# Altium schematic sheet LCL_2.SchDoc
size A4; SheetNumber: 3; SheetTotal: 5
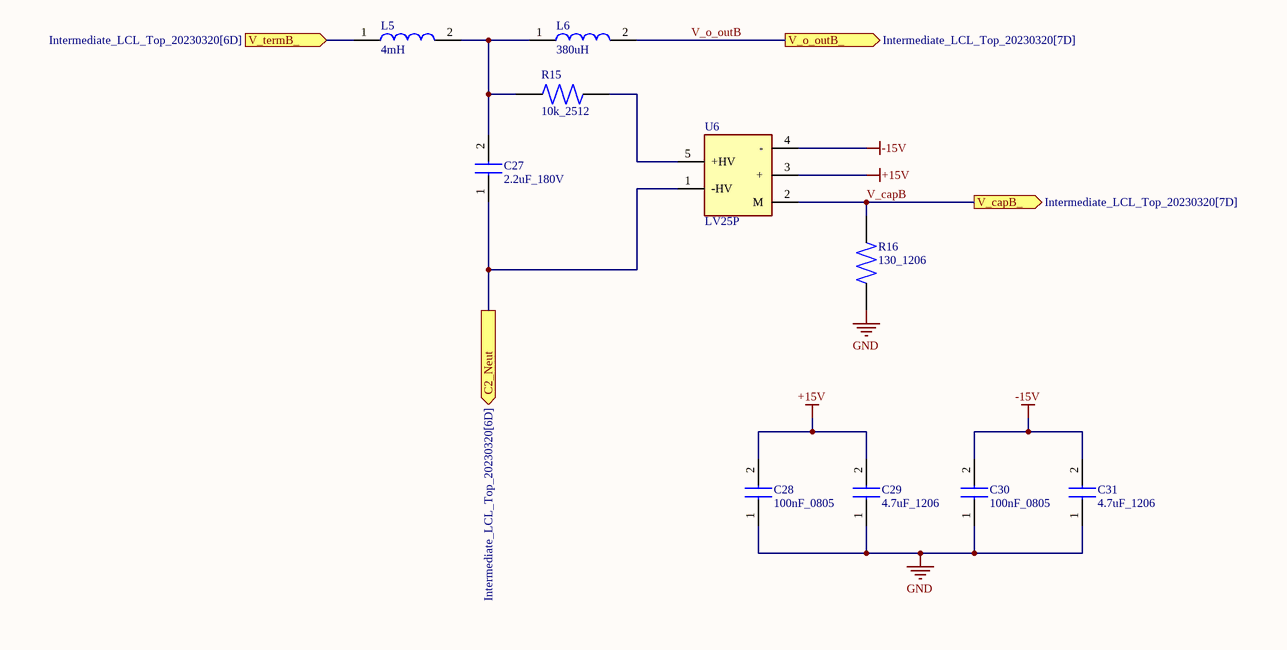
[diagram p0: LCL_2.SchDoc]

## Parts
C27  2.2uF_180V  [Film Capacitor PHE450HF7220JR06L2]
C28  100nF_0805  [0805 Capacitor]
C29  4.7uF_1206  [1206 Capacitor]
C30  100nF_0805  [0805 Capacitor]
C31  4.7uF_1206  [1206 Capacitor]
L5  4mH  [4mH Custom]
L6  380uH  [380uH Custom]
R15  10k_2512  [2512 Resistor]
R16  130_1206  [1206 Resistor]
U6  LV25P  [LV-25-P]

## Ports
C2_Neut (out, see Intermediate_LCL_Top_20230320[6D]), V_capB_ (out, see Intermediate_LCL_Top_20230320[7D]), V_o_outB_ (out, see Intermediate_LCL_Top_20230320[7D]), V_termB_ (in, see Intermediate_LCL_Top_20230320[6D])

## Nets
+15V: C28.2 C29.2 U6.3(+)
-15V: C30.2 C31.2 U6.4(-)
GND: C28.1 C29.1 C30.1 C31.1 R16.1
C2_Neut: C27.1 U6.1(-HV) ; port C2_Neut
V_capB: R16.2 U6.2(M) ; port V_capB_
V_o_outB: L6.2 ; port V_o_outB_
V_termB_: L5.1 ; port V_termB_
NetC27_2: C27.2 L5.2 L6.1 R15.1
NetR15_2: R15.2 U6.5(+HV)

## Library data of the parts
C27 = PHE450HF7220JR06L2: KEMET PHE450 Metallised Polypropylene Film Capacitor, 180 V ac, 250 V dc, ±5%, 2.2μF, Through Hole; Datasheet Link: https://docs.rs-online.com/a458/0900766b817170df.pdf; Height: 24.5mm; Manufacturer_Name: KEMET; Manufacturer_Part_Number: PHE450HF7220JR06L2
C28 C30 = C0805C104J5RACTU: SMD Multilayer Ceramic Capacitor, 0.1 µF, 50 V, 0805 [2012 Metric], ± 5%, X7R, C Series KEMET
C29 C31 = C3216X7R1H475K160AC: SMD Multilayer Ceramic Capacitor, 4.7 µF, 50 V, 1206 [3216 Metric], ± 10%, X7R, C; MP: C1206C120J5GACTU; Package: None; Price: None; Value: *; Availability: Unavailable
L5 = 4mH Custom Inductor
L6 = 380uH Custom Inductor
R15 = MCHP122WF1002T4E: SMD Chip Resistor, 10 kohm, ± 1%, 2 W, 2512 [6432 Metric], Thick Film, High Power; MF: Bourns; MP: CRE2512-FZ-R007E-3; Mouser-Purchase-URL: https://snapeda.com/shop?store=Mouser&id=836123; Price: None; Package: 6432 Stackpole; Value: *; SnapEDA_Link: https://www.snapeda.com/parts/CRE2512-FZ-R007E-3/Bourns/view-part/836123/?ref=snap; DigiKey-Purchase-URL: https://snapeda.com/shop?store=DigiKey&id=836123; Availability: Good
R16 = CRCW1206130RFKEA: SMD Chip Resistor, 130 ohm, ± 1%, 250 mW, 1206 [3216 Metric], Thick Film, General Purpose; MF: Bourns; MP: CRE2512-FZ-R007E-3; Mouser-Purchase-URL: https://snapeda.com/shop?store=Mouser&id=836123; Price: None; Package: 6432 Stackpole; Value: *; SnapEDA_Link: https://www.snapeda.com/parts/CRE2512-FZ-R007E-3/Bourns/view-part/836123/?ref=snap; DigiKey-Purchase-URL: https://snapeda.com/shop?store=DigiKey&id=836123; Availability: Good
U6 = LV25P: Undefined or Miscellaneous; Manufacturer_Name: LEM; Manufacturer_Part_Number: LV25P